# EAGLE design ExplorerBoard-0BAC0503 (EAGLE 5.10)
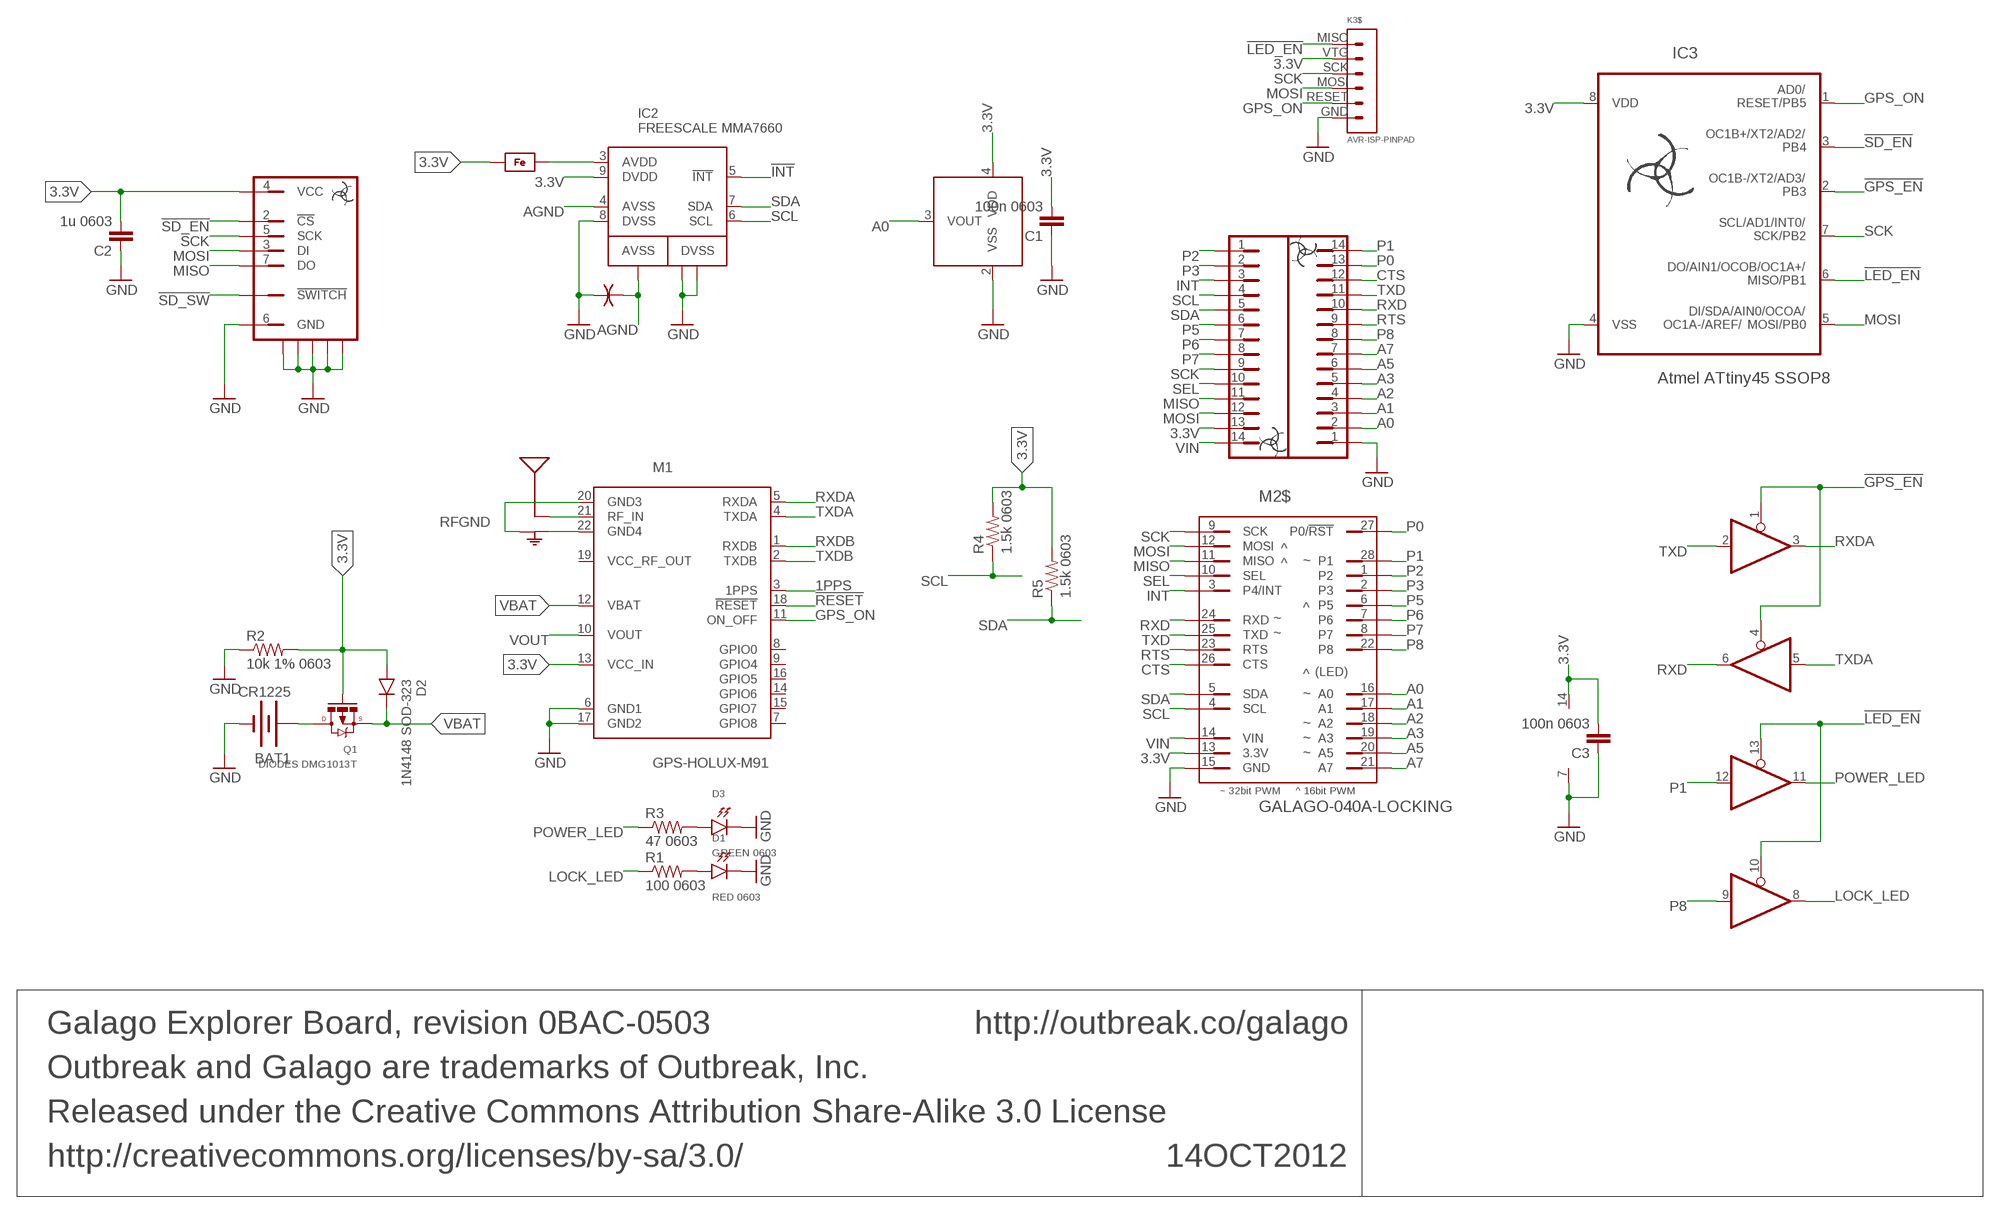
[diagram p0: schematic, sheet 1]

## Parts
14OCT2012  Galago Explorer Board, revision 0BAC-0503  INFO-BLOCK  [INFO-BLOCK]
ANT1  ANTENNA-SMA-GPS-PULSE-W3010  [ANTENNA-SMD-GPS-PULSE-W3010]
BAT1  CR1225  BATTERY12MM  [BATTCON_12MM]
C1  100n 0603  CAP-0603  [0603]
C2  1u 0603  CAP-0603  [0603]
C3  100n 0603  CAP-0603  [0603]
D1  RED 0603  LED-0603  [0603-DIODE]
D2  1N4148 SOD-323  DIODE-SOD323  [SOD-323]
D3  GREEN 0603  LED-0603  [0603-DIODE]
FB1  60@100MHz 0603  FERRITE-BEAD-0603  [0603]
IC1  74HC125-TSSOP14  [TSSOP14]
IC2  FREESCALE MMA7660  ACCELEROMETER-FREESCALE-MMA7660  [QFN10-3X3MM-FREESCALE-MMA7660]
IC3  Atmel ATtiny45 SSOP8  AVR-ATTINY25/45/85-TSSOP8  [TSSOP8]
IC4  MICROCHIP MCP9700A SC70-5  MICROCHIP-9700/01/A-LINEAR-ACTIVE-THERMISTOR-SC70-5  [SC70-5]
K1$  HEADER-1X14-NO-SILK-CHUNKY  [HEADER-1X14-NO-SILK-CHUNKY]
K2$  HEADER-1X14-NO-SILK-CHUNKY  [HEADER-1X14-NO-SILK-CHUNKY]
K3$  AVR-ISP-PINPAD  [AVR-ISP-PINPAD]
K4  MICROSD HIROSE-DM3D-SF  SD-OR-MICROSD-SPI-MODE-WITH-SWITCH-HIROSE-DM3D-SF  [HIROSE-MICROSD-SOCKET-DM3D-SF]
M1  GPS-HOLUX-M91  [GPS-HOLUX-M91]
M2$  GALAGO-040A-LOCKING  [GALAGO-LOCKING]
Q1  DIODES DMG1013T  MOSFET-P-CHANNEL-DIODES-DMG1013T-STRETCHED  [SC-75A-STRETCHED]
R1  100 0603  RESISTOR-0603  [0603]
R2  10k 1% 0603  RESISTOR-0603-MIN  [0603-MIN]
R3  47 0603  RESISTOR-0603  [0603]
R4  1.5k 0603  RESISTOR-0603  [0603]
R5  1.5k 0603  RESISTOR-0603  [0603]
U$3  GND-ISOLATOR-0.016"  [GND-ISOLATOR-0.016"]

## Nets
1PPS: M1.3(1PPS)
3.3V: C1.1 C2.1 C3.1 D2.A FB1.1 IC1.14(VDD) IC2.9(DVDD) IC3.8(VDD) IC4.4(VDD) K1$.13 K3$.VTG K4.4(VCC) M1.13(VCC_IN) M2$.13(3.3V) Q1.1(GATE) R2.2 R4.2 R5.2
!GPS_EN: IC1.1(EN) IC1.4(EN) IC3.2(PB3)
!INT: IC2.5(!INT)
!LED_EN: IC1.10(EN) IC1.13(EN) IC3.6(MISO/PB1) K3$.MISO
!RESET: M1.18(!RESET)
!SD_EN: IC3.3(PB4) K4.2(!CS)
!SD_SW: K4.SWITCH(!SWITCH)
A0: IC4.3(VOUT) K2$.2 M2$.16(A0)
A1: K2$.3 M2$.17(A1)
A2: K2$.4 M2$.18(A2)
A3: K2$.5 M2$.19(A3)
A5: K2$.6 M2$.20(A5)
A7: K2$.7 M2$.21(A7)
AGND: IC2.1(G3) IC2.4(AVSS) U$3.B
CTS: K2$.12 M2$.26(CTS)
GND: BAT1.GND(-) C1.2 C2.2 C3.2 D1.2(K) D3.2(K) IC1.7(VSS) IC2.8(DVSS) IC2.G1 IC2.G2 IC3.4(VSS) IC4.2(VSS) K2$.1 K3$.GND K4.6(GND) K4.PP$1 K4.PP$2 K4.PP$3 K4.PP$4 K4.PP$5 M1.6(GND1) M1.17(GND2) M2$.15(GND) R2.1 U$3.A
GPS_ON: IC3.1(RESET/PB5) K3$.RESET M1.11(ON_OFF)
INT: K1$.3 M2$.3(P4/INT)
LOCK_LED: IC1.8(Y) R1.1
MISO: K1$.11 K4.7(DO) M2$.11(MISO)
MOSI: IC3.5(MOSI/PB0) K1$.12 K3$.MOSI K4.3(DI) M2$.12(MOSI)
N$2: D3.1(A) R3.2
N$10: FB1.2 IC2.3(AVDD)
N$28: D1.1(A) R1.2
P0: K2$.13 M2$.27(P0/!RST)
P1: IC1.12(A) K2$.14 M2$.28(P1)
P2: K1$.1 M2$.1(P2)
P3: K1$.2 M2$.2(P3)
P5: K1$.6 M2$.6(P5)
P6: K1$.7 M2$.7(P6)
P7: K1$.8 M2$.8(P7)
P8: IC1.9(A) K2$.8 M2$.22(P8)
POWER_LED: IC1.11(Y) R3.1
RF: ANT1.RF M1.21(RF_IN)
RFGND: ANT1.GND@1(GND) ANT1.GND@2(GND) M1.20(GND3) M1.22(GND4)
RTS: K2$.9 M2$.23(RTS)
RXD: IC1.6(Y) K2$.10 M2$.24(RXD)
RXDA: IC1.3(Y) M1.5(RXDA)
RXDB: M1.1(RXDB)
SCK: IC3.7(SCK/PB2) K1$.9 K3$.SCK K4.5(SCK) M2$.9(SCK)
SCL: IC2.6(SCL) K1$.4 M2$.4(SCL) R4.1
SDA: IC2.7(SDA) K1$.5 M2$.5(SDA) R5.1
SEL: K1$.10 M2$.10(SEL)
TXD: IC1.2(A) K2$.11 M2$.25(TXD)
TXDA: IC1.5(A) M1.4(TXDA)
TXDB: M1.2(TXDB)
VBAT: D2.K M1.12(VBAT) Q1.2(SOURCE)
VIN: K1$.14 M2$.14(VIN)
VOUT: M1.10(VOUT)
VRAWBAT: BAT1.PWR@1(+) Q1.3(DRAIN)
Unconnected: M1.7(GPIO8) M1.8(GPIO0) M1.9(GPIO4) M1.14(GPIO6) M1.15(GPIO7) M1.16(GPIO5) M1.19(VCC_RF_OUT)

## Library data of the parts
14OCT2012 = Outbreak:INFO-BLOCK
ANT1 = Outbreak:ANTENNA-SMA
BAT1 = SparkFun:BATTERY: Battery Holders Various common sizes : AA, AAA, 20mm coin cell and 12mm coin cell.
C1-C3 = Outbreak:CAP
D1 D3 = Outbreak:LED
D2 = Outbreak:DIODE
FB1 = Outbreak:FERRITE-BEAD
IC1 = Outbreak:74HC125
IC2 = Outbreak:ACCELEROMETER-FREESCALE-MMA7660
IC3 = Outbreak:AVR-ATTINY25/45/85
IC4 = Outbreak:MICROCHIP-9700/01/A-LINEAR-ACTIVE-THERMISTOR
K1$ K2$ = Outbreak:HEADER-1X14-NO-SILK
K3$ = Outbreak:AVR-ISP-PINPAD
K4 = Outbreak:SD-OR-MICROSD-SPI-MODE-WITH-SWITCH
M1 = Outbreak:GPS-HOLUX-M91
M2$ = Outbreak-v0:GALAGO-040A
Q1 = Outbreak:MOSFET-P-CHANNEL
R1-R5 = Outbreak:RESISTOR: Resistor Basic schematic elements and footprints for 0603, 1206, and PTH resistors.
U$3 = Outbreak:GND-ISOLATOR

## Board
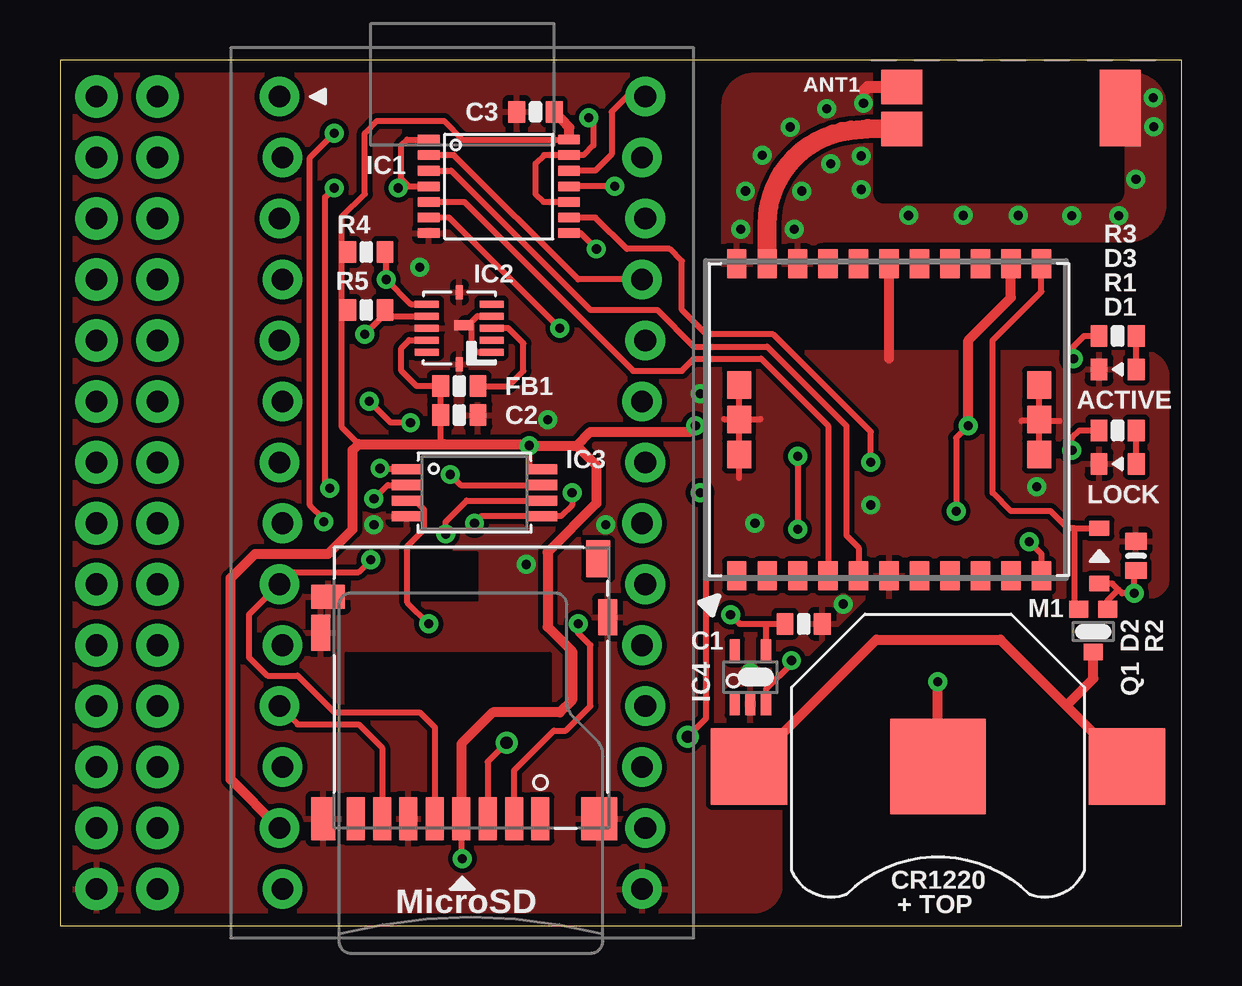
[diagram p1: board, top side]
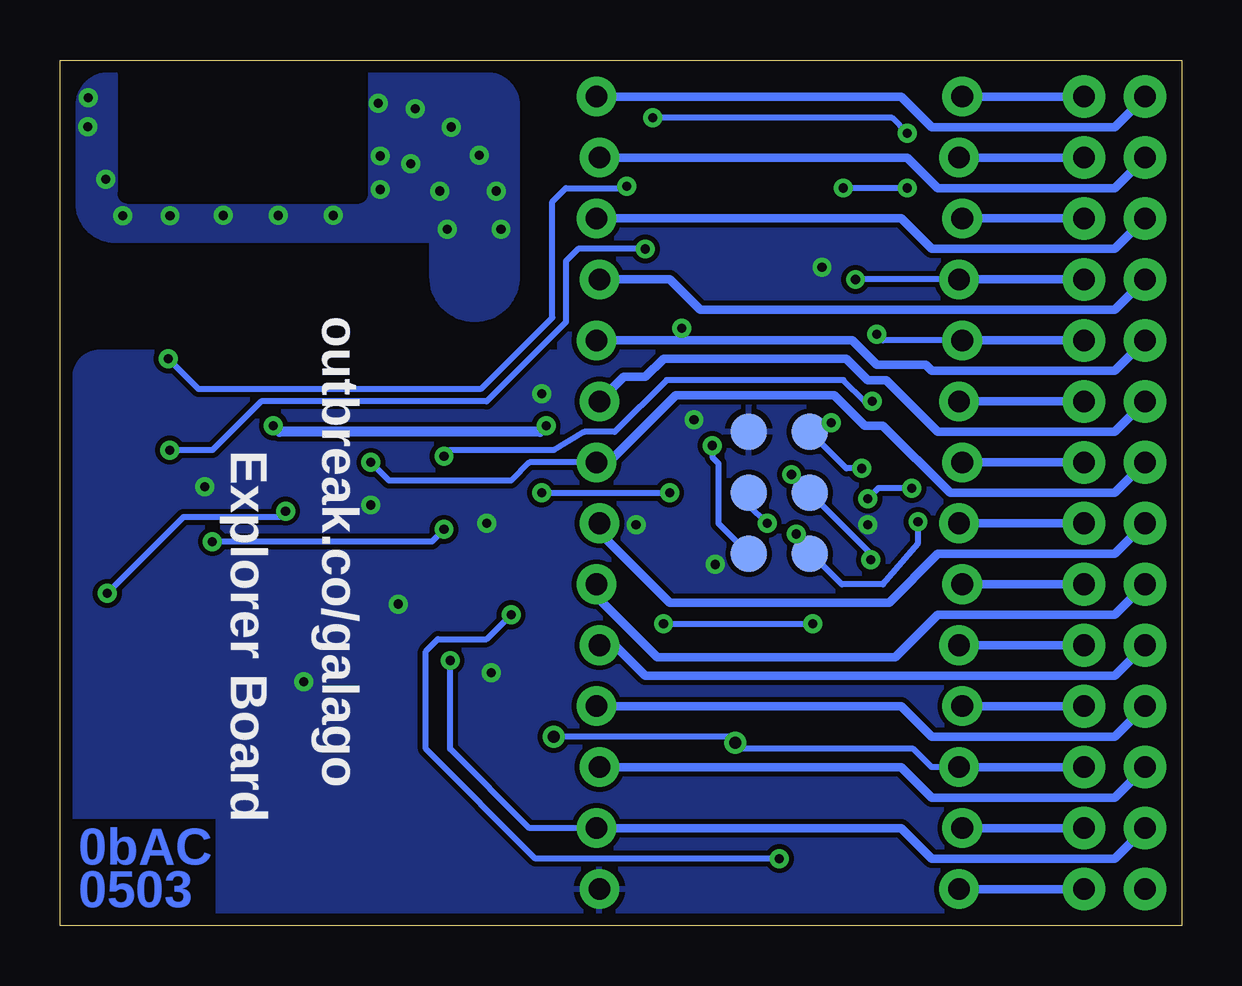
[diagram p2: board, bottom side, seen from below]

Size 46.74 x 36.07 mm. Coordinates in mm from the lower left corner, seen from the top.
Outline: 0,0 46.74,0 46.74,36.07 0,36.07 0,0
Copper layers (1*16): Top 0.035mm / dielectric 1.5mm / Bottom 0.035mm
Design rules "default *": minimum track width 8mil, minimum drill 20mil, track to track 8mil, track to pad 8mil, pad to pad 8mil, via to via 8mil, smd to smd 8mil, copper to edge 20mil, drill to drill 8mil, minimum pad ring 10mil, minimum via ring 8mil, stop-mask expansion 4mil, vias tented up to drill 20mil, thermal gap 10mil
tRestrict: area 34.3,30.5 to 43.9,35.6
bRestrict: area 34.3,30.5 to 43.9,35.6

### Footprints (pad centres in the part's own frame; a part is rotated, then mirrored left to right if it is on the bottom)
ANTENNA-SMD-GPS-PULSE-W3010 = smd 1.7 x 3.2: GND@1 -4.55,2 | smd 1.7 x 1.45: GND@2 4.55,1.125; RF 4.55,2.875
BATTCON_12MM = smd 3.962 x 3.962: GND 0,0 | smd 3.175 x 3.175: PWR@1 -7.874,0; PWR@2 7.874,0
0603 = smd 0.7 x 0.9: 1 -0.777,0; 2 0.777,0
0603-DIODE = smd 0.7 x 0.9: 1 -0.777,0; 2 0.777,0
SOD-323 = smd 0.63 x 0.83: A -1.15,0; K 1.15,0
TSSOP14 = smd 0.4 x 0.9: 1 2.275,2.925; 2 1.625,2.925; 3 0.975,2.925; 4 0.325,2.925; 5 -0.325,2.925; 6 -0.975,2.925; 7 -1.625,2.925; 8 -1.625,-2.925; 9 -0.975,-2.925; 10 -0.325,-2.925; 11 0.325,-2.925; 12 0.975,-2.925; 13 1.625,-2.925; 14 2.275,-2.925
QFN10-3X3MM-FREESCALE-MMA7660 = smd 0.29 x 1: 1 1,1.35; 2 0.5,1.35; 3 0,1.35; 4 -0.5,1.35; 5 -1,1.35; 6 -1,-1.35; 7 -0.5,-1.35; 8 0,-1.35; 9 0.5,-1.35; 10 1,-1.35 | smd 0.6 x 0.29: G1 -1.5,0; G2 1.5,0
TSSOP8 = smd 1.25 x 0.42: 1 -2.825,0.975; 2 -2.825,0.325; 3 -2.825,-0.325; 4 -2.825,-0.975; 5 2.825,-0.975; 6 2.825,-0.325; 7 2.825,0.325; 8 2.825,0.975
SC70-5 = smd 0.42 x 0.95: 1 0.65,1.1; 2 0,1.1; 3 -0.65,1.1; 4 -0.65,-1.1; 5 0.65,-1.1
HEADER-1X14-NO-SILK-CHUNKY = drill 0.9 pad 1.778 round: 1 0,0; 2 2.54,0; 3 5.08,0; 4 7.62,0; 5 10.16,0; 6 12.7,0; 7 15.24,0; 8 17.78,0; 9 20.32,0; 10 22.86,0; 11 25.4,0; 12 27.94,0; 13 30.48,0; 14 33.02,0
AVR-ISP-PINPAD = smd 1.524 x 1.524: GND 2.54,1.27; MISO -2.54,-1.27; MOSI 0,1.27; RESET 2.54,-1.27; SCK 0,-1.27; VTG -2.54,1.27
HIROSE-MICROSD-SOCKET-DM3D-SF = smd 0.75 x 1.8: 1 2.62,-4.18; 2 1.52,-4.18; 3 0.42,-4.18; 4 -0.68,-4.18; 5 -1.78,-4.18; 6 -2.88,-4.18; 7 -3.98,-4.18; 8 -5.08,-4.18 | smd 1.4 x 1: PP$1 -6.23,5.07 | smd 0.8 x 1.5: PP$2 -6.53,3.57; PP$5 5.42,4.22 | smd 1 x 1.8: PP$3 -6.43,-4.18 | smd 1.5 x 1.8: PP$4 5.07,-4.18 | smd 1 x 1.55: SWITCH 5.02,6.645
GPS-HOLUX-M91 = smd 1.2 x 0.8: 1 -6.5,6.35; 2 -6.5,5.08; 3 -6.5,3.81; 4 -6.5,2.54; 5 -6.5,1.27; 6 -6.5,0; 7 -6.5,-1.27; 8 -6.5,-2.54; 9 -6.5,-3.81; 10 -6.5,-5.08; 11 -6.5,-6.35; 12 6.5,-6.35; 13 6.5,-5.08; 14 6.5,-3.81; 15 6.5,-2.54; 16 6.5,-1.27; 17 6.5,0; 18 6.5,1.27; 19 6.5,2.54; 20 6.5,3.81; 21 6.5,5.08; 22 6.5,6.35 | smd 1.15 x 1: G1 1.445,6.25; G2 0,6.25; G3 -1.455,6.25; G4 -1.455,-6.25; G5 0,-6.25; G6 1.445,-6.25
GALAGO-LOCKING = drill 0.9 pad 1.651 round: 1 -7.62,16.51; 2 -7.493,13.97; 3 -7.62,11.43; 4 -7.493,8.89; 5 -7.62,6.35; 6 -7.493,3.81; 7 -7.62,1.27; 8 -7.493,-1.27; 9 -7.62,-3.81; 10 -7.493,-6.35; 11 -7.62,-8.89; 12 -7.493,-11.43; 13 -7.62,-13.97; 14 -7.493,-16.51; 15 7.493,-16.51; 16 7.62,-13.97; 17 7.493,-11.43; 18 7.62,-8.89; 19 7.493,-6.35; 20 7.62,-3.81; 21 7.493,-1.27; 22 7.62,1.27; 23 7.493,3.81; 24 7.62,6.35; 25 7.493,8.89; 26 7.62,11.43; 27 7.493,13.97; 28 7.62,16.51
SC-75A-STRETCHED = smd 0.8 x 0.7: 1 0.6,0.926; 2 -0.6,0.926; 3 0,-0.851
0603-MIN = smd 0.7 x 0.9: 1 -0.61,0; 2 0.61,0
GND-ISOLATOR-0.016" = smd 0.406 x 0.406: A -0.191,0; B 0.191,0

### Placement (x,y rotation side)
14OCT2012  1.78,-5.33 0 top  (outside the outline)
ANT1  39.62,36.07 180 top
BAT1  36.58,6.63 180 top
C1  30.99,12.57 0 top
C2  16.64,21.27 0 top
C3  19.81,33.91 180 top
D1  44.07,19.24 180 top
D2  43.31,15.41 90 top
D3  44.07,23.18 180 top
FB1  16.64,22.48 0 top
IC1  18.29,30.48 90 top
IC2  16.64,24.89 270 top
IC3  17.27,18.03 0 top
IC4  28.77,10.35 180 top
K1$  4.06,34.54 270 top
K2$  1.52,1.52 90 top
K3$  16.76,18.03 90 bottom
K4  17.4,8.64 0 top
M1  34.54,21.08 90 top
M2$  16.76,18.03 0 top
Q1  43.05,12.26 0 top
R1  44.07,20.64 0 top
R2  44.83,15.41 270 top
R3  44.07,24.57 0 top
R4  12.76,28.07 180 top
R5  12.76,25.65 180 top
U$3  16.83,25.02 0 top

### Tracks (layer width: path | path; a pad name or v marks a point on that pad's centre or on a via)
3.3V  (via drill 0.38)
  Top 0.254: IC2.9 14.55,24.39 14.22,24.07 14.22,23.11 14.86,22.48 FB1.1 C2.1 15.86,20.21 16,20.07 | IC3.8 19.56,19.01 v19.56,20 | v16.76,2.79 16.72,2.84 K4.4 | v37.34,17.27 37.34,20.32 v37.85,20.83 | 29.46,12.57 28.32,12.57 v27.94,12.95 | 29.46,12.57 C1.1 | IC4.4 29.42,12.52 29.46,12.57 | 12.45,20.07 11.75,20.77 11.75,25.65 | 11.75,25.65 11.75,28.07 | 11.75,28.07 11.75,29.53 12.7,30.48 12.7,33.02 13.21,33.53 16,33.53 16.77,32.76 IC1.14 | 11.75,28.07 R4.2 | 11.75,25.65 R5.2 | R2.2 44.77,14.73 v44.77,13.84 44.26,13.84 44.1,14 | D2.A 43.85,14.26 44.1,14 | Q1.1 43.65,13.55 44.1,14
  Top 0.406: M2$.13 7.11,6.1 7.11,14.48 8.13,15.49 11.18,15.49 12.19,16.51 12.19,19.81 12.45,20.07 16,20.07 19.49,20.07 v19.56,20 21.53,20 | M1.13 39.62,26.16 37.85,24.38 v37.85,20.83 | K4.4 16.72,7.58 18.03,8.89 20.83,8.89 21.34,9.4 21.34,11.43 20.32,12.45 20.32,15.56 22.35,17.59 22.35,19.18 21.53,20 | v26.48,20.83 26.23,20.57 22.1,20.57 21.53,20 | IC1.14 21.22,33.25 C3.1
  Bottom 0.254: K3$.VTG 19.3,16.76 19.3,19.26 19.56,19.52 v19.56,20 | v37.34,17.27 37.59,17.02 41.59,17.02 v44.77,13.84 | v16.76,2.79 26.92,2.79 31.5,7.37 31.5,11.43 30.99,11.94 28.96,11.94 v27.94,12.95
  Bottom 0.356: K1$.13 M2$.13
  Bottom 0.406: v37.85,20.83 37.59,20.57 26.73,20.57 v26.48,20.83
!GPS_EN  (via drill 0.38)
  Top 0.254: IC1.1 14.47,32.76 14.22,32.51 14.22,31.11 | 14.22,31.11 14.53,30.8 IC1.4 | IC3.2 13.66,18.36 v13.08,17.78 | v14.1,30.73 14.22,30.86 14.22,31.11 | v11.43,30.73 11.05,30.35 11.05,18.41 v11.24,18.22
  Bottom 0.254: v11.24,18.22 12.64,18.22 v13.08,17.78 | v11.43,30.73 v14.1,30.73
!LED_EN  (via drill 0.38)
  Top 0.254: IC1.10 20.14,30.16 19.81,30.48 19.81,31.75 20.17,32.1 IC1.13 21.82,32.1 22.23,32.51 22.23,33.47 v22.04,33.66 | v16.07,16.32 16.07,16.83 16.95,17.71 IC3.6 | v10.99,16.83 10.99,16.95 10.41,17.53 10.41,32 v11.43,33.02
  Bottom 0.254: v16.07,16.32 15.49,15.75 K3$.MISO 15.43,15.49 14.16,14.22 12.45,14.22 10.99,15.94 v10.99,16.83 | v11.43,33.02 12.06,33.66 v22.04,33.66
!SD_EN  (via drill 0.38)
  Top 0.254: IC3.3 14.8,17.71 15.18,17.34 15.18,16.51 14.48,15.81 14.48,13.46 v15.37,12.57 | v21.59,12.57 21.59,12.19 22.1,11.68 22.1,9.14 21.08,8.13 20.57,8.13 18.92,6.47 K4.2
  Bottom 0.254: v21.59,12.57 v15.37,12.57
A0  (via drill 0.38)
  Top 0.254: v30.48,11.05 30.48,10.92 29.42,9.86 IC4.3
  Bottom 0.254: M2$.16 27.18,4.06 30.48,7.37 v30.48,11.05
  Bottom 0.356: K2$.2 2.79,2.79 10.41,2.79 11.68,4.06 M2$.16
A1
  Bottom 0.356: K2$.3 2.79,5.33 10.41,5.33 11.68,6.6 M2$.17 24.38,6.6
A2
  Bottom 0.356: K2$.4 2.79,7.87 10.41,7.87 11.68,9.14 M2$.18
A3
  Bottom 0.356: K2$.5 2.79,10.41 22.35,10.41 23.62,11.68 M2$.19 24.38,11.68
A5
  Bottom 0.356: K2$.6 2.79,12.95 10.16,12.95 11.94,11.18 21.84,11.18 24.38,13.72 M2$.20
A7
  Bottom 0.356: K2$.7 2.79,15.49 10.16,15.49 12.19,13.46 21.34,13.46 24.26,16.38 M2$.21
AGND
  Top 0.254: IC2.4 17.39,25.39 17.14,25.15 17.14,25.02 | 17.14,25.02 17.14,24.13 17.38,23.89 IC2.1 | U$3.B 17.14,25.02
CTS
  Bottom 0.356: K2$.12 2.79,28.19 10.41,28.19 11.68,29.46 M2$.26
GND  (via drill 0.38)
  Top 0.254: 28.3,18.64 28.3,22.96 | 27.66,21.11 29.18,21.11 | 40.79,21.03 40.79,21.06 | 40.79,21.03 40.06,21.03 | 40.79,19.63 40.79,21.03 | 40.79,21.06 40.82,21.03 41.66,21.03 | 40.79,21.06 40.79,22.53
  Top 0.406: 34.54,23.62 M1.17 | v36.58,10.16 BAT1.GND
  other vias: 19.43,15.05 13.08,16.7 20.32,21.08 22.73,16.7 26.67,22.16 40.7,18.29 14.99,27.43 28.77,10.54 28.96,16.76 33.78,17.53 32.64,13.4
  pour Top (rank 2): 0,36.07 24.38,36.07 arc-90 25.91,35.05 25.91,23.88 45.09,23.88 arc-90 46.1,22.86 46.1,14.48 arc-90 45.34,13.72 33.53,13.72 29.97,10.16 29.97,1.71 arc-90 28.96,0.64 28.96,0 0,0
  pour Bottom (rank 3): 0,36.07 24.38,36.07 arc-90 25.91,35.05 25.91,23.88 45.09,23.88 arc-90 46.1,22.86 46.23,4.57 40.13,4.57 40.13,0 5.08,0 0,5.08
GPS_ON  (via drill 0.38)
  Top 0.254: v13.34,19.05 13.36,19.01 IC3.1 | M1.11 40.89,15.49 v40.39,16 | v30.73,19.56 v30.73,16.51 | v12.89,21.84 13.78,20.95 v14.61,20.95
  Bottom 0.254: v13.34,19.05 13.97,19.05 K3$.RESET 15.11,20.95 v14.61,20.95 | v40.39,16 31.24,16 v30.73,16.51 | v30.73,19.56 30.48,19.81 26.16,19.81 24.89,20.57 23.62,20.57 21.46,22.73 14.1,22.73 13.21,21.84 v12.89,21.84
INT
  Bottom 0.356: K1$.3 M2$.3
LOCK_LED  (via drill 0.38)
  Top 0.254: R1.1 42.48,20.64 42.16,20.32 v42.16,19.81 | v22.35,28.19 21.69,28.86 IC1.8
  Bottom 0.254: v42.16,19.81 40.39,19.81 38.35,21.84 28.96,21.84 25.65,25.15 25.65,27.69 25.15,28.19 v22.35,28.19
MISO
  Top 0.254: K4.7 13.42,7.41 12.45,8.38 9.91,8.38 M2$.11
  Bottom 0.356: K1$.11 M2$.11
MOSI  (via drill 0.38, 0.51)
  Top 0.254: K4.3 17.82,6.82 v18.61,7.62 | v17.27,16.76 17.57,17.06 IC3.5 20.87,17.06 21.34,17.53 v21.34,18.03 | v26.67,18.03 26.92,17.78 26.92,8.64 v26.16,7.87
  Bottom 0.254: M2$.12 10.41,6.6 11.18,7.37 18.35,7.37 v18.61,7.62 18.86,7.87 v26.16,7.87 | v17.27,16.76 18.03,17.53 K3$.MOSI | v26.67,18.03 v21.34,18.03
  Bottom 0.356: K1$.12 M2$.12
N$2
  Top 0.254: D3.1 R3.2
N$10
  Top 0.254: IC2.3 18.67,24.89 19.3,24.26 19.3,23.11 18.67,22.48 FB1.2
N$28
  Top 0.254: D1.1 R1.2
P0
  Bottom 0.356: K2$.13 2.79,30.73 10.16,30.73 11.43,32 M2$.27
P1
  Top 0.254: IC1.12 22.31,31.45 22.99,32.13 22.99,33.91 23.62,34.54 M2$.28
  Bottom 0.356: K2$.14 2.79,33.27 10.41,33.27 11.68,34.54 M2$.28
P2
  Bottom 0.356: K1$.1 M2$.1
P3
  Bottom 0.356: K1$.2 M2$.2
P5
  Bottom 0.356: K1$.6 M2$.6
P6
  Bottom 0.356: K1$.7 M2$.7
P7
  Bottom 0.356: K1$.8 M2$.8
P8  (via drill 0.38)
  Top 0.254: IC1.9 22.31,29.5 23.62,28.19 25.4,28.19 25.91,27.69 25.91,25.65 26.92,24.64 29.72,24.64 33.78,20.57 v33.78,19.3
  Bottom 0.254: M2$.22 27.18,19.3 27.94,18.54 33.02,18.54 v33.78,19.3
  Bottom 0.356: K2$.8 2.79,18.03 9.65,18.03 12.45,20.83 13.21,20.83 14.48,22.1 21.08,22.1 23.88,19.3 M2$.22
POWER_LED  (via drill 0.38)
  Top 0.254: R3.1 42.67,24.57 42.23,24.13 v42.23,23.62 | v23.11,30.8 IC1.11
  Bottom 0.254: v42.23,23.62 40.96,22.35 29.21,22.35 26.23,25.34 26.23,30.16 25.65,30.73 23.18,30.73 v23.11,30.8
RF
  Top 0.787: M1.21 29.46,29.21 arc-83 32.96,33.15 arc-11 ANT1.RF
RFGND  (via drill 0.38)
  Top 0.508: ANT1.GND@2 33.67,34.94 33.53,34.8
  other vias: 28.56,30.61 29.26,32.11 44.12,29.58 31.94,34.04 28.36,29.02 45.55,34.49 44.83,31.1 30.43,33.27 39.93,29.59 33.48,34.26 45.58,33.29 42.15,29.58 37.64,29.59 35.36,29.59 33.39,30.67 33.39,32.07 32.12,31.75 30.91,30.61 30.59,29.02
  pour Top: 27.69,34.16 arc-90 28.96,35.43 44.7,35.43 arc-90 45.97,34.16 45.97,30.1 arc-90 44.45,28.57 31.75,28.57 arc90 31.24,28.07 31.24,27.05 arc-90 29.46,25.27 arc-90 27.69,27.05
  pour Bottom: 27.69,34.16 arc-90 28.96,35.43 44.7,35.43 arc-90 45.97,34.16 45.97,30.1 arc-90 44.45,28.57 31.24,28.57 31.24,27.05 arc-90 29.46,25.27 arc-90 27.69,27.05
RTS
  Bottom 0.356: K2$.9 2.79,20.57 10.16,20.57 12.32,22.73 13.08,22.73 13.97,23.62 21.59,23.62 22.35,22.86 23.24,22.86 M2$.23
RXD  (via drill 0.38)
  Top 0.254: IC1.6 16.21,29.5 v20.83,24.89
  Bottom 0.254: 20.83,24.38 v20.83,24.89
  Bottom 0.356: K2$.10 2.79,23.11 10.41,23.11 10.67,23.37 12.7,23.37 13.72,24.38 20.83,24.38 M2$.24
RXDA
  Top 0.254: M1.5 33.27,15.75 32.77,16.26 32.77,20.83 29.46,24.13 26.42,24.13 24.89,25.65 22.1,25.65 16.3,31.45 IC1.3
SCK  (via drill 0.38)
  Top 0.254: K4.5 15.62,8.26 14.99,8.89 11.43,8.89 9.91,10.41 8.64,10.41 7.87,11.18 7.87,12.95 M2$.9 9.65,14.73 12.45,14.73 v12.95,15.24 | v16.26,18.8 16.69,18.36 IC3.7
  Bottom 0.254: v16.26,18.8 K3$.SCK 12.95,15.49 v12.95,15.24
  Bottom 0.356: K1$.9 M2$.9
SCL  (via drill 0.38)
  Top 0.254: IC2.6 14.62,25.89 v13.59,26.92 13.59,28.02 R4.1
  Bottom 0.254: M2$.4 v13.59,26.92
  Bottom 0.356: K1$.4 M2$.4
SDA  (via drill 0.38)
  Top 0.254: 13.54,25.39 IC2.7 | v12.7,24.64 13.45,25.39 13.54,25.39 | 13.54,25.39 R5.1
  Bottom 0.254: M2$.5 12.45,24.38 v12.7,24.64
  Bottom 0.356: K1$.5 M2$.5
SEL
  Bottom 0.356: K1$.10 M2$.10
TXD
  Top 0.254: IC1.2 16.41,32.1 21.59,26.92 M2$.25
  Bottom 0.356: K2$.11 2.79,25.65 20.07,25.65 21.34,26.92 M2$.25
TXDA
  Top 0.254: M1.4 32,20.83 29.21,23.62 26.42,23.62 25.91,23.11 23.88,23.11 16.84,30.16 IC1.5
VBAT
  Top 0.254: 40.92,27.56 M1.12 40.89,26.42 38.86,24.38 38.86,18.03 39.62,17.27 41.27,17.27 41.99,16.55 42.29,16.55 | 42.29,16.55 D2.K | Q1.2 42.29,13.34 42.29,16.55
VIN
  Bottom 0.356: K1$.14 M2$.14
VRAWBAT
  Top 0.406: BAT1.PWR@1 41.93,9.16 | 28.7,6.6 34.01,11.91 39.18,11.91 41.93,9.16 | Q1.3 43.05,10.29 41.93,9.16

### Text on the board
Bottom: 0bAC | 0503
tPlace: ACTIVE | LOCK | CR1220 | MicroSD | + TOP
bPlace: outbreak.co/galago | Explorer Board
tTest: Galago Explorer App Board | 0BAC-0503 (Top Side)
Reference: 0bAC | GPS | 0502 | Pulse W3010 | GPS Antenna | (c) Outbreak, Inc 2012